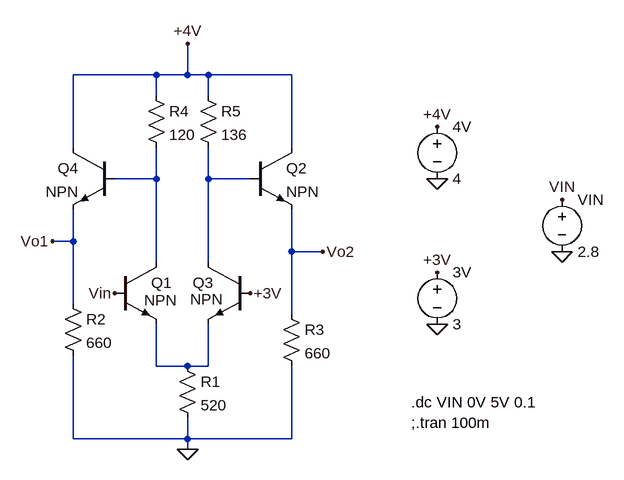
[diagram p0: schematic Vleft(Not)Gate.asc]
Vleft(Not)Gate.asc, the LTspice schematic file:
Version 4.1
SHEET 1 1352 680
WIRE 368 -192 240 -192
WIRE 416 -192 416 -240
WIRE 416 -192 368 -192
WIRE 448 -192 416 -192
WIRE 576 -192 448 -192
WIRE 368 -160 368 -192
WIRE 448 -160 448 -192
WIRE 240 -80 240 -192
WIRE 576 -80 576 -192
WIRE 368 -32 368 -80
WIRE 368 -32 304 -32
WIRE 448 -32 448 -80
WIRE 512 -32 448 -32
WIRE 240 64 240 16
WIRE 240 64 208 64
WIRE 576 80 576 16
WIRE 624 80 576 80
WIRE 368 96 368 -32
WIRE 448 96 448 -32
WIRE 240 160 240 64
WIRE 576 176 576 80
WIRE 368 256 368 192
WIRE 416 256 368 256
WIRE 448 256 448 192
WIRE 448 256 416 256
WIRE 240 368 240 240
WIRE 416 368 416 336
WIRE 416 368 240 368
WIRE 576 368 576 256
WIRE 576 368 416 368
WIRE 416 384 416 368
FLAG 416 384 0
FLAG 800 -32 0
FLAG 800 192 0
FLAG 800 112 +3V
FLAG 512 144 +3V
FLAG 416 -240 +4V
FLAG 800 -112 +4V
FLAG 208 64 Vo1
FLAG 624 80 Vo2
FLAG 992 80 0
FLAG 992 0 VIN
FLAG 304 144 Vin
SYMBOL npn 304 96 R0
WINDOW 3 45 59 Left 2
SYMATTR InstName Q1
SYMBOL npn 512 -80 R0
SYMATTR InstName Q2
SYMBOL npn 512 96 M0
WINDOW 3 42 57 Left 2
SYMATTR InstName Q3
SYMBOL npn 304 -80 M0
SYMATTR InstName Q4
SYMBOL res 400 240 R0
SYMATTR InstName R1
SYMATTR Value 520
SYMBOL res 224 144 R0
SYMATTR InstName R2
SYMATTR Value 660
SYMBOL res 560 160 R0
SYMATTR InstName R3
SYMATTR Value 660
SYMBOL res 352 -176 R0
SYMATTR InstName R4
SYMATTR Value 120
SYMBOL res 432 -176 R0
SYMATTR InstName R5
SYMATTR Value 136
SYMBOL voltage 800 -128 R0
WINDOW 123 0 0 Left 0
WINDOW 39 0 0 Left 0
SYMATTR InstName 4V
SYMATTR Value 4
SYMBOL voltage 800 96 R0
WINDOW 123 0 0 Left 0
WINDOW 39 0 0 Left 0
SYMATTR InstName 3V
SYMATTR Value 3
SYMBOL voltage 992 -16 R0
WINDOW 123 0 0 Left 0
WINDOW 39 0 0 Left 0
SYMATTR InstName VIN
SYMATTR Value 2.8
TEXT 760 312 Left 2 !.dc VIN 0V 5V 0.1\n;.tran 100m

The netlist it stands for:
* Vleft(Not)Gate.asc
Q1 N001 VIN N003 0 NPN
Q2 +4V N002 Vo2 0 NPN
Q3 N002 +3V N003 0 NPN
Q4 +4V N001 Vo1 0 NPN
R1 N003 0 520
R2 Vo1 0 660
R3 Vo2 0 660
R4 +4V N001 120
R5 +4V N002 136
V§4V +4V 0 4
V§3V +3V 0 3
VIN VIN 0 2.8
.model NPN NPN
.model PNP PNP
.lib standard.bjt
.dc VIN 0V 5V 0.1
;.tran 100m
.backanno
.end